# EAGLE design team_flag (EAGLE 7.4.0)
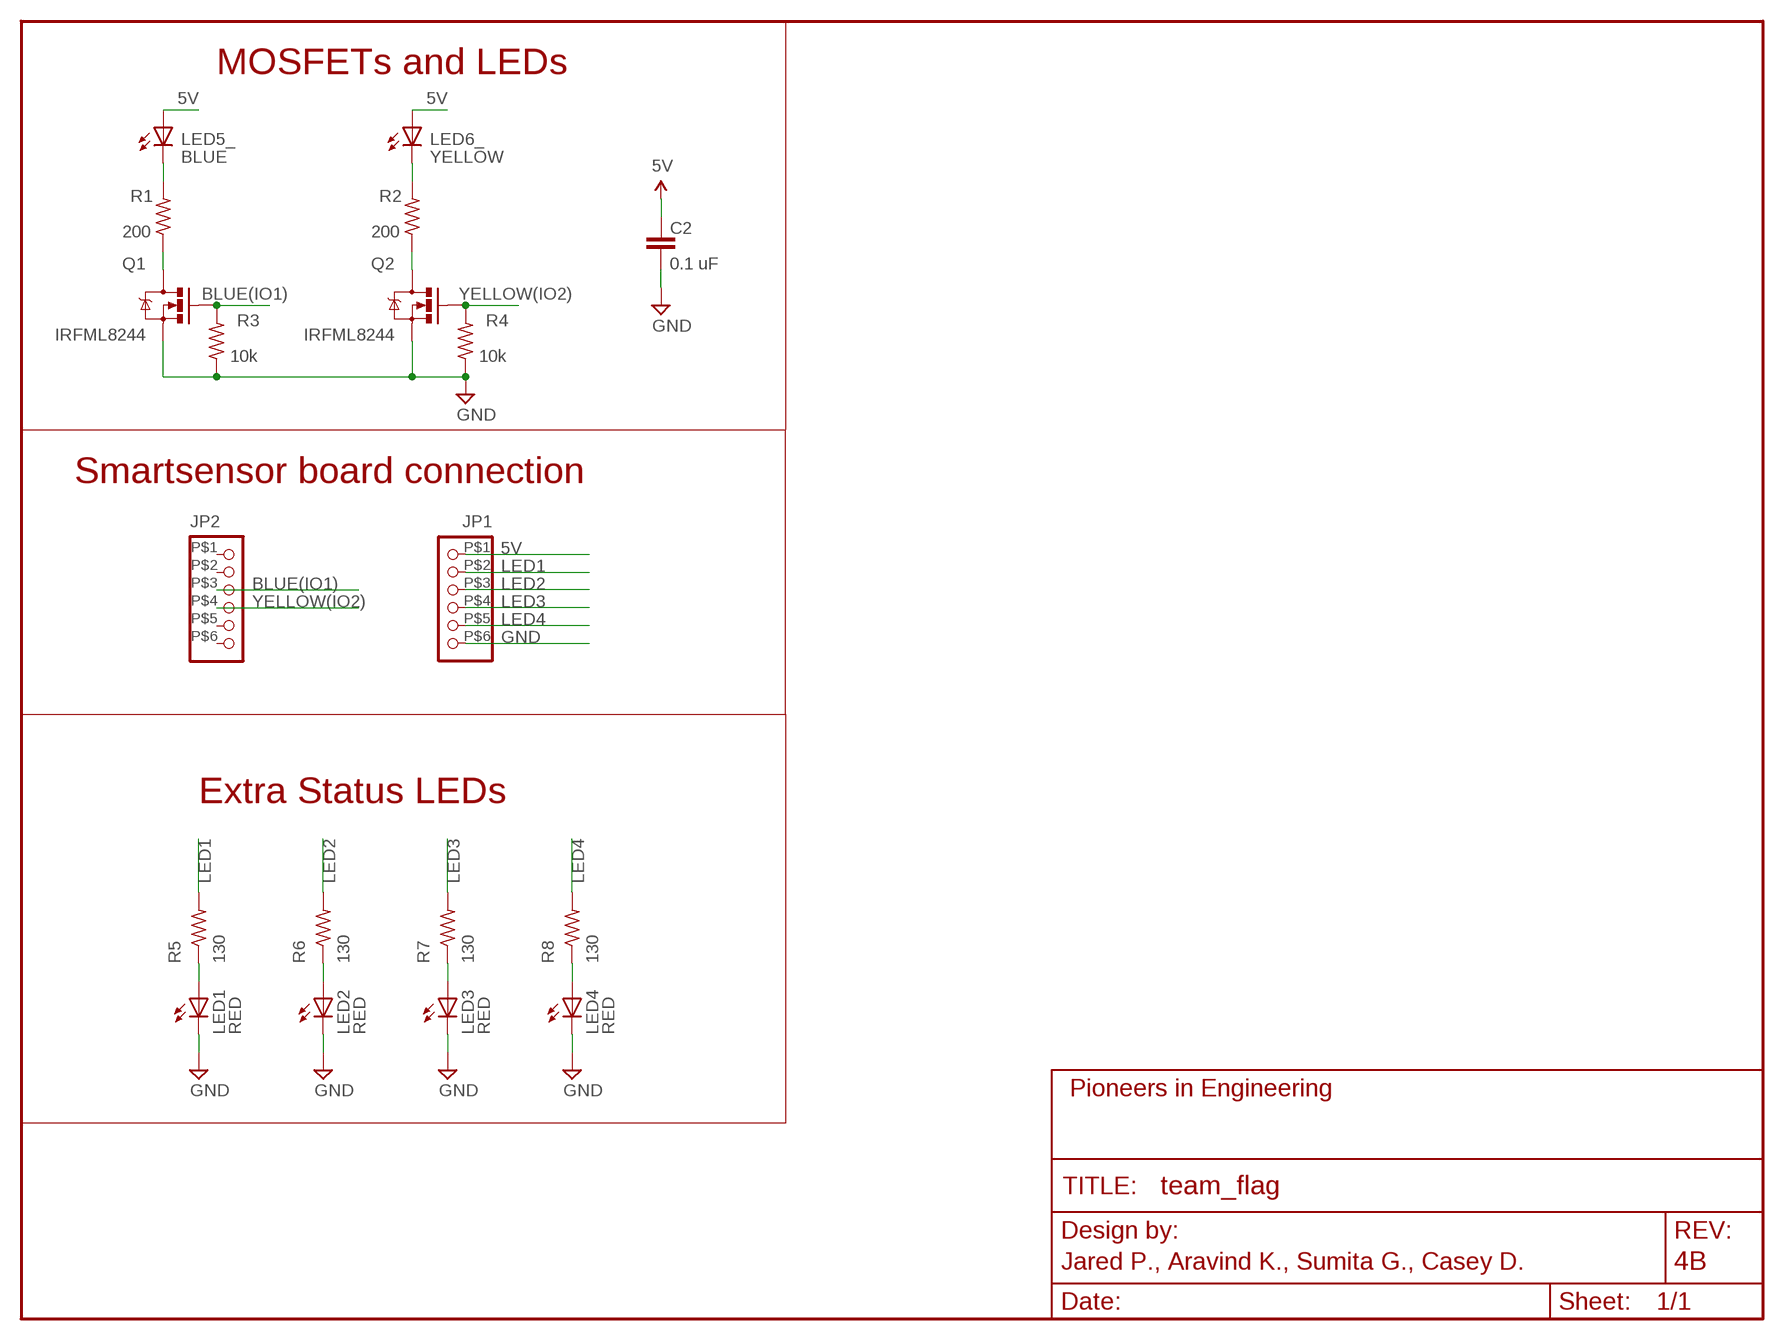
[diagram p0: schematic, sheet 1]
FRAME1 (FRAME-LETTER): AUTHOR: Jared P., Aravind K., Sumita G., Casey D.; REVISION: 4B

## Parts
C2  0.1 uF  CAP0603-CAP  [0603-CAP]
JP1  PINHD-1X6SMD-C  [1X06-SMD-C]
JP2  PINHD-1X6SMD-C  [1X06-SMD-C]
LED1  RED  LED0805  [LED-0805]
LED2  RED  LED0805  [LED-0805]
LED3  RED  LED0805  [LED-0805]
LED4  RED  LED0805  [LED-0805]
LED5_  BLUE  LEDLED5MM-NOFLAT  [LED5MM-NOFLAT]
LED6_  YELLOW  LEDLED5MM-NOFLAT  [LED5MM-NOFLAT]
Q1  IRFML8244  MOSFET-NCHANNELSMD  [SOT23-3]
Q2  IRFML8244  MOSFET-NCHANNELSMD  [SOT23-3]
R1  200  R-US_R0603  [R0603]
R2  200  R-US_R0603  [R0603]
R3  10k  R-US_R0603  [R0603]
R4  10k  R-US_R0603  [R0603]
R5  130  R-US_R0603  [R0603]
R6  130  R-US_R0603  [R0603]
R7  130  R-US_R0603  [R0603]
R8  130  R-US_R0603  [R0603]

## Nets
5V: C2.1 JP1.P$1 LED5_.A LED6_.A
BLUE(IO1): JP2.P$3 Q1.1(G) R3.2
BSOURCE: Q1.3(D) R1.1
GND: C2.2 JP1.P$6 LED1.C LED2.C LED3.C LED4.C Q1.2(S) Q2.2(S) R3.1 R4.1
LED1: JP1.P$2 R5.2
LED2: JP1.P$3 R6.2
LED3: JP1.P$4 R7.2
LED4: JP1.P$5 R8.2
N$1: LED2.A R6.1
N$2: LED5_.K(C) R1.2
N$3: LED6_.K(C) R2.2
N$4: LED1.A R5.1
N$5: LED3.A R7.1
N$6: LED4.A R8.1
YELLOW(IO2): JP2.P$4 Q2.1(G) R4.2
YSOURCE: Q2.3(D) R2.1
Unconnected: JP2.P$1 JP2.P$2 JP2.P$5 JP2.P$6

## Notes on the sheet
- MOSFETs and LEDs
- Smartsensor board connection
- Extra Status LEDs

## Library data of the parts
C2 = pie:CAP: Capacitor Standard 0603 ceramic capacitor, and 0.1" leaded capacitor.; PIE-INT-REF-NUM: CAPACITOR-GENERIC
JP1 JP2 = pie:PINHD-1X6: 6-pin 0.1-inch header; DIGIKEY-PN: S1013E-36-ND
LED1-LED4 LED5_ LED6_ = pie:LED: LEDs Standard schematic elements and footprints for 5mm, 3mm, 1206, and 0603 sized LEDs. 5mm - Spark Fun Electronics SKU : COM-00529 (and others); PIE-INT-REF-NUM: LED
Q1 Q2 = pie:MOSFET-NCHANNEL: N-Type MOSFET, SOT23-3 Package; PIE-INT-REF-NUM: NMOS
R1-R8 = pie:R-US_: RESISTOR, American symbol; PIE-INT-REF-NUM: RESISTOR-GENERIC

## Board
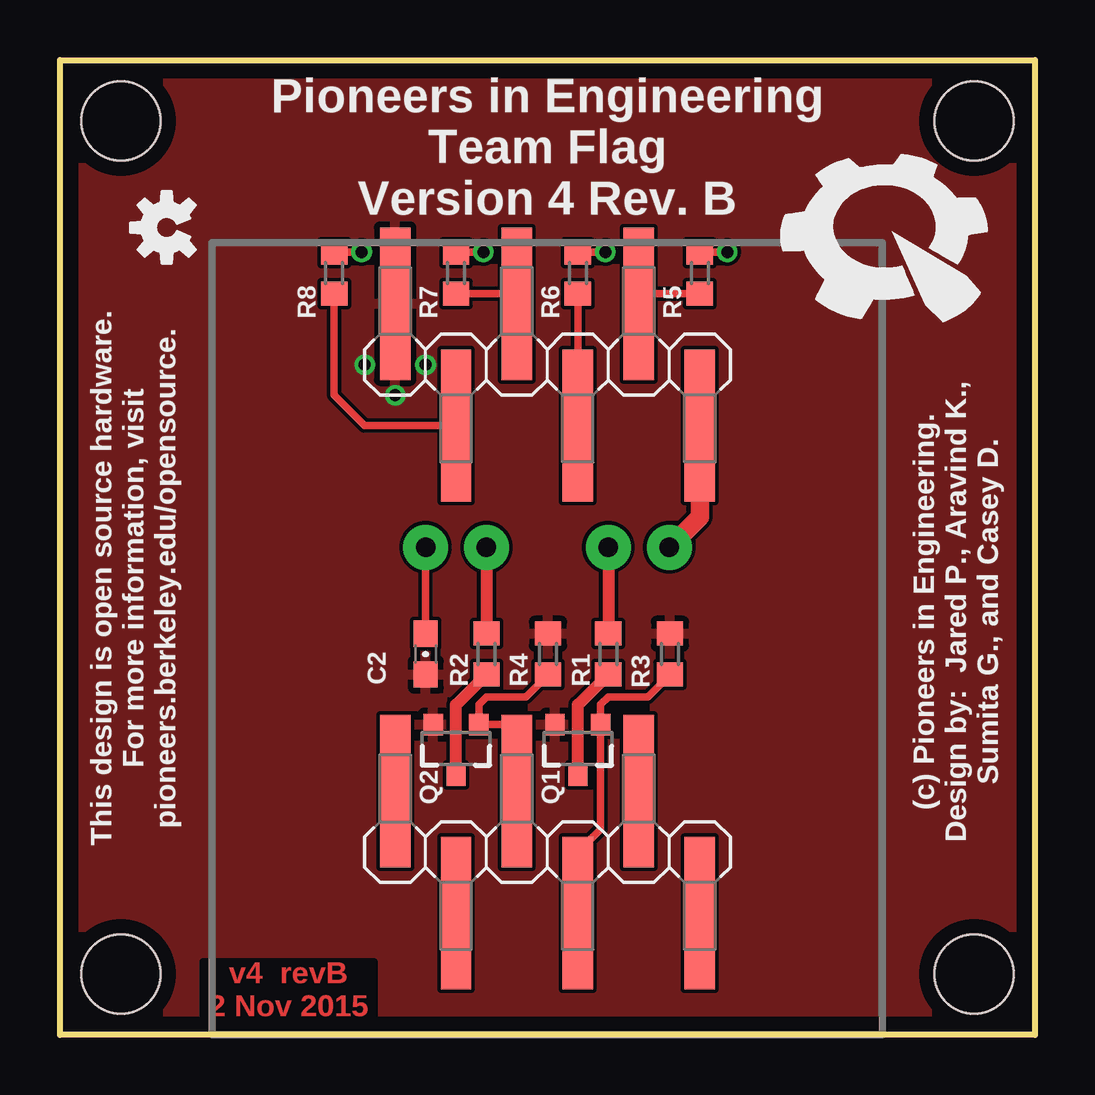
[diagram p1: board, top side]
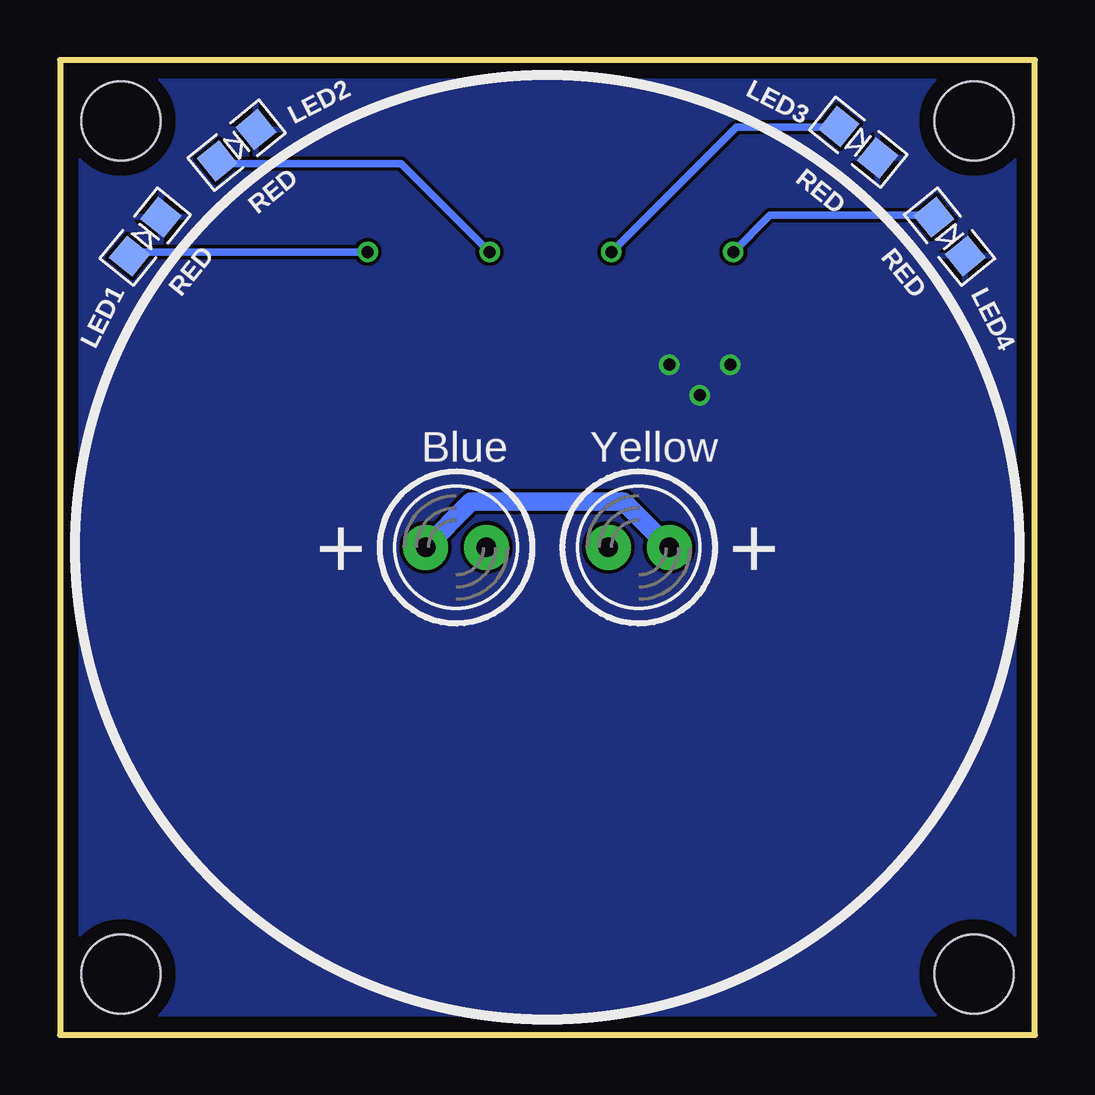
[diagram p2: board, bottom side, seen from below]

Size 40.64 x 40.64 mm. Coordinates in mm from the lower left corner, seen from the top.
Outline: 40.64,0 0,0 0,40.64 40.64,40.64 40.64,0
Copper layers (1*16): Top 2mil / dielectric 9mil / Bottom 2mil
Design rules "advancedcircuits-33each-pie": minimum track width 6mil, minimum drill 15mil, track to track 6mil, track to pad 6mil, pad to pad 6mil, via to via 6mil, smd to smd 6mil, copper to edge 25mil, drill to drill 7mil, minimum pad ring 7mil, minimum via ring 7mil, stop-mask expansion 3mil, vias tented up to drill 21mil, thermal gap 10mil

### Footprints (pad centres in the part's own frame; a part is rotated, then mirrored left to right if it is on the bottom)
0603-CAP = smd 1.1 x 1: 1 -0.85,0; 2 0.85,0
1X06-SMD-C = smd 1.27 x 6.35: P$1 -6.35,2.54; P$2 -3.81,-2.54; P$3 -1.27,2.54; P$4 1.27,-2.54; P$5 3.81,2.54; P$6 6.35,-2.54
LED-0805 = smd 1.194 x 1.245: A -1.041,0; C 1.041,0
LED5MM-NOFLAT = drill 0.813 pad 1.88: A -1.27,0; K 1.27,0
SOT23-3 = smd 0.8 x 0.9: 1 -0.95,-1; 2 0.95,-1; 3 0,1.1
R0603 = smd 1 x 1.1: 1 -0.85,0; 2 0.85,0
STAND-OFF = hole 3.302: 0,0

### Placement (x,y rotation side)
C2  15.24,15.88 270 top
JP1  20.32,27.94 180 top
JP2  20.32,7.62 180 top
LED1  37.08,33.27 51 bottom
LED2  33.27,37.08 39 bottom
LED3  7.37,37.21 321 bottom
LED4  3.56,33.27 309 bottom
LED5_  24.13,20.32 0 bottom
LED6_  16.51,20.32 180 bottom
Q1  21.59,11.94 180 top
Q2  16.51,11.94 180 top
R1  22.86,15.88 90 top
R2  17.78,15.88 90 top
R3  25.43,15.88 270 top
R4  20.35,15.88 270 top
R5  26.67,31.75 270 top
R6  21.59,31.75 270 top
R7  16.51,31.75 270 top
R8  11.43,31.75 270 top
U$1  [PIE-LOGO-SMALL]  34.67,33.53 0 top
U$2  [OSHW-LOGO-S]  4.45,33.66 90 top
U$11  [STAND-OFF]  38.1,38.1 0 top
U$12  [STAND-OFF]  2.54,38.1 0 top
U$13  [STAND-OFF]  2.54,2.54 0 top
U$14  [STAND-OFF]  38.1,2.54 0 top

### Tracks (layer width: path | path; a pad name or v marks a point on that pad's centre or on a via)
5V
  Top 0.305: LED6_.A C2.1
  Top 0.762: JP1.P$1 26.67,21.59 LED5_.A
  Bottom 0.762: LED5_.A 23.5,22.23 17.14,22.23 LED6_.A
BLUE(IO1)
  Top 0.305: R3.2 25.43,15.01 24.51,14.1 22.86,14.1 22.54,13.78 Q1.1 22.54,8.57 21.59,7.62 JP2.P$3
BSOURCE
  Top 0.508: Q1.3 21.59,13.76 R1.1
GND  (via drill 0.5)
  Top 0.305: JP1.P$6 13.97,27.94
  other vias: 12.7,27.94 13.97,26.67 15.24,27.94
  pour Top: 0,40.64 40.64,40.64 40.64,0 0,0
  pour Bottom (rank 2): 40.64,0 0,0 0,40.64 40.64,40.64
LED1
  Top 0.305: R5.2 24.55,30.9 JP1.P$2
LED2
  Top 0.305: R6.2 JP1.P$3
LED3
  Top 0.305: R7.2 18.63,30.9 JP1.P$4
LED4
  Top 0.305: R8.2 11.43,26.67 12.7,25.4 JP1.P$5
N$1  (via drill 0.5)
  Top 0.305: R6.1 21.63,32.64 v22.73,32.64
  Bottom 0.305: LED2.A 33.98,36.32 26.42,36.32 v22.73,32.64
N$2
  Top 0.508: LED5_.K R1.2
N$3
  Top 0.508: LED6_.K R2.2
N$4  (via drill 0.5)
  Top 0.305: R5.1 26.71,32.64 v27.81,32.64
  Bottom 0.305: LED1.A 37.56,32.64 v27.81,32.64
N$5  (via drill 0.5)
  Top 0.305: R7.1 16.55,32.64 v17.65,32.64
  Bottom 0.305: LED3.A 8.2,37.85 12.45,37.85 v17.65,32.64
N$6  (via drill 0.5)
  Top 0.305: R8.1 11.47,32.64 v12.57,32.64
  Bottom 0.305: LED4.A 4.29,34.16 11.05,34.16 v12.57,32.64
YELLOW(IO2)
  Top 0.305: R4.2 20.34,15.01 19.43,14.1 17.78,14.1 17.46,13.78 Q2.1 19.03,12.94 19.05,12.95 JP2.P$4
YSOURCE
  Top 0.508: Q2.3 16.51,13.76 R2.1

### Text on the board
Top: v4 revB / 2 Nov 2015
tPlace: Pioneers in Engineering / Team Flag / Version 4 Rev. B | This design is open source hardware. / For more information, visit / pioneers.berkeley.edu/opensource. | (c) Pioneers in Engineering. / Design by: Jared P., Aravind K., / Sumita G., and Casey D.
bPlace: Yellow | Blue
tDocu: Smart Device